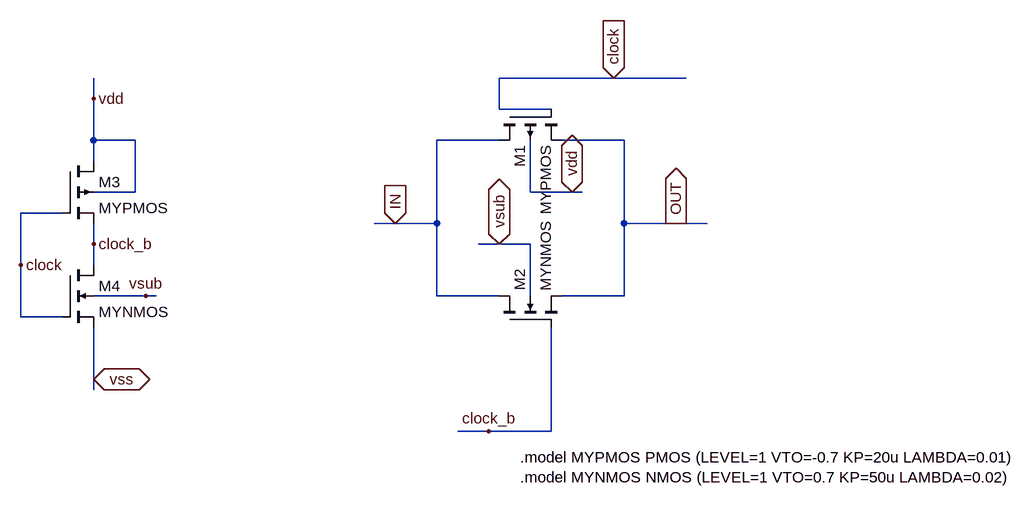
[diagram p0: schematic dsproj_cmossampleandhold.asc]
dsproj_cmossampleandhold.asc, the LTspice schematic file:
Version 4.1
SHEET 1 1400 756
WIRE 128 -208 -48 -208
WIRE 240 -208 128 -208
WIRE -672 -176 -672 -208
WIRE -48 -160 -48 -208
WIRE 32 -160 -48 -160
WIRE -672 -112 -672 -176
WIRE -608 -112 -672 -112
WIRE -48 -112 -144 -112
WIRE 144 -112 48 -112
WIRE -672 -80 -672 -112
WIRE -608 -32 -608 -112
WIRE -608 -32 -672 -32
WIRE 0 -32 0 -112
WIRE 64 -32 0 -32
WIRE 80 -32 64 -32
WIRE -720 0 -784 0
WIRE -208 16 -240 16
WIRE -144 16 -144 -112
WIRE -144 16 -208 16
WIRE 144 16 144 -112
WIRE 224 16 144 16
WIRE 272 16 224 16
WIRE -672 48 -672 16
WIRE -48 48 -80 48
WIRE 0 48 -48 48
WIRE -784 80 -784 0
WIRE -672 80 -672 48
WIRE -592 128 -672 128
WIRE -576 128 -592 128
WIRE -144 128 -144 16
WIRE -48 128 -144 128
WIRE 0 128 0 48
WIRE 144 128 144 16
WIRE 144 128 48 128
WIRE -784 160 -784 80
WIRE -720 160 -784 160
WIRE -672 256 -672 176
WIRE -672 272 -672 256
WIRE -64 336 -112 336
WIRE 32 336 32 176
WIRE 32 336 -64 336
FLAG 128 -208 clock
IOPIN 128 -208 In
FLAG 64 -32 vdd
IOPIN 64 -32 BiDir
FLAG -48 48 vsub
IOPIN -48 48 BiDir
FLAG -208 16 IN
IOPIN -208 16 In
FLAG 224 16 OUT
IOPIN 224 16 Out
FLAG -592 128 vsub
FLAG -672 -176 vdd
FLAG -784 80 clock
FLAG -672 48 clock_b
FLAG -64 336 clock_b
FLAG -672 256 vss
IOPIN -672 256 BiDir
SYMBOL pmos4 -48 -160 M90
SYMATTR InstName M1
SYMATTR Value MYPMOS
SYMATTR Value2 l=180e-9 w=2400e-9
SYMBOL nmos4 -48 176 R270
SYMATTR InstName M2
SYMATTR Value MYNMOS
SYMATTR Value2 l=180e-9 w=1200e-9
SYMBOL pmos4 -720 -80 R0
SYMATTR InstName M3
SYMATTR Value MYPMOS
SYMATTR Value2 l=180e-9 w=2.4e-6 m=1
SYMBOL nmos4 -720 80 R0
SYMATTR InstName M4
SYMATTR Value MYNMOS
SYMATTR Value2 l=180e-9 w=1.2e-6 m=1
TEXT -16 376 Left 2 !.model MYPMOS PMOS (LEVEL=1 VTO=-0.7 KP=20u LAMBDA=0.01)\n.model MYNMOS NMOS (LEVEL=1 VTO=0.7 KP=50u LAMBDA=0.02)

The netlist it stands for:
* dsproj_cmossampleandhold.asc
M1 IN clock OUT vdd MYPMOS l=180e-9 w=2400e-9
M2 IN clock_b OUT vsub MYNMOS l=180e-9 w=1200e-9
M3 vdd clock clock_b vdd MYPMOS l=180e-9 w=2.4e-6 m=1
M4 clock_b clock vss vsub MYNMOS l=180e-9 w=1.2e-6 m=1
.model NMOS NMOS
.model PMOS PMOS
.lib standard.mos
.model MYPMOS PMOS (LEVEL=1 VTO=-0.7 KP=20u LAMBDA=0.01)
.model MYNMOS NMOS (LEVEL=1 VTO=0.7 KP=50u LAMBDA=0.02)
.backanno
.end